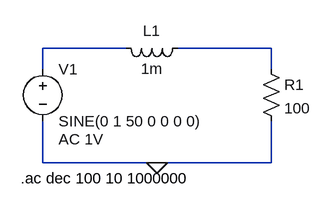
[diagram p0: schematic series_inductor_filter_1mH.asc]
series_inductor_filter_1mH.asc, the LTspice schematic file:
Version 4
SHEET 1 880 680
WIRE 240 96 112 96
WIRE 464 96 320 96
WIRE 112 128 112 96
WIRE 464 128 464 96
WIRE 112 272 112 208
WIRE 288 272 112 272
WIRE 464 272 464 208
WIRE 464 272 288 272
FLAG 288 272 0
SYMBOL voltage 112 112 R0
WINDOW 123 24 124 Left 2
WINDOW 39 0 0 Left 0
SYMATTR InstName V1
SYMATTR Value SINE(0 1 50 0 0 0 0)
SYMATTR Value2 AC 1V
SYMBOL res 448 112 R0
SYMATTR InstName R1
SYMATTR Value 100
SYMBOL ind 336 80 R90
WINDOW 0 5 56 VBottom 2
WINDOW 3 32 56 VTop 2
SYMATTR InstName L1
SYMATTR Value 1m
TEXT 78 296 Left 2 !.ac dec 100 10 1000000

The netlist it stands for:
* series_inductor_filter_1mH.asc
V1 N001 0 SINE(0 1 50 0 0 0 0) AC 1V
R1 N002 0 100
L1 N002 N001 1m
.ac dec 100 10 1000000
.backanno
.end